# Altium schematic sheet K60FN_LQFP144.SchDoc
size A4
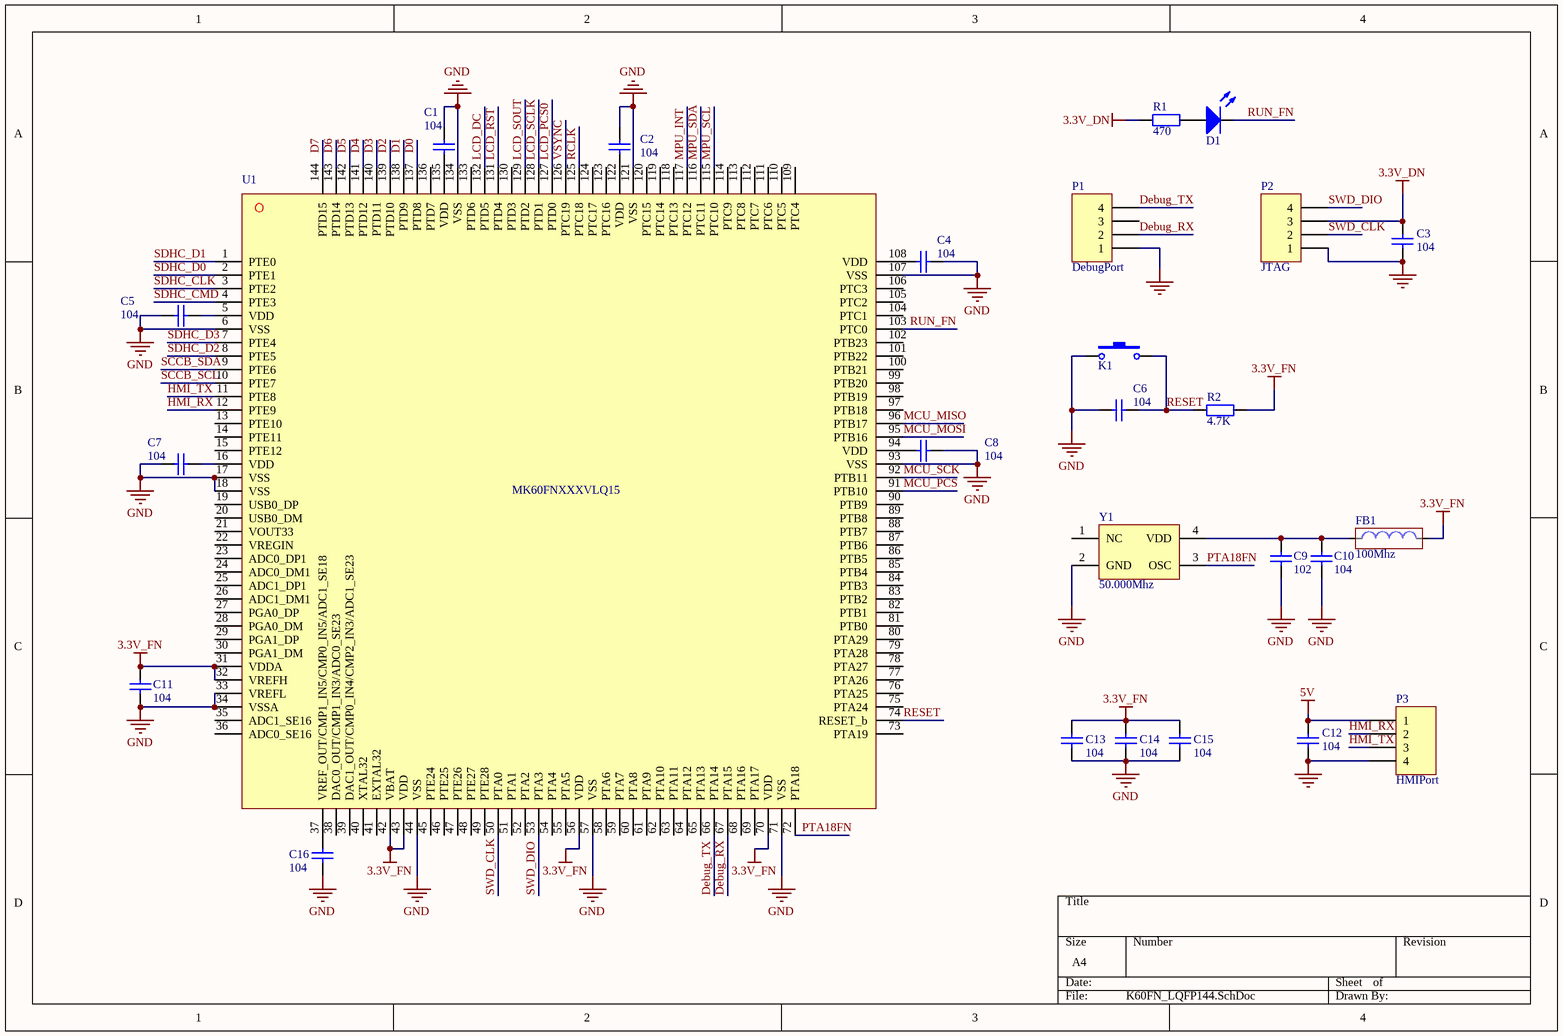
[diagram p0: K60FN_LQFP144.SchDoc]

## Parts
C1  104  [0805]
C2  104  [0805]
C3  104  [0805]
C4  104  [0805]
C5  104  [0805]
C6  104  [0805]
C7  104  [0805]
C8  104  [0805]
C9  102  [0805]
C10  104  [0805]
C11  104  [0805]
C12  104  [0805]
C13  104  [0805]
C14  104  [0805]
C15  104  [0805]
C16  104  [0805]
D1  Led  [0805]  (value not drawn)
FB1  100Mhz  [0805]
K1  SW-PB  [2P按键]  (value not drawn)
P1  DebugPort  [PJ-322]
P2  JTAG  [PJ-322]
P3  HMIPort  [4P-2.54]
R1  470  [0805]
R2  4.7K  [0805]
U1  MK60FNXXXVLQ15  [LQFP-144]
Y1  50.000Mhz  [XTAL-3225]

## Nets
3.3V_DN: C3.1 P2.3 R1.1
3.3V_FN: C11.2 C13.2 C14.2 C15.2 FB1.2 R2.2 U1.31(VDDA) U1.32(VREFH) U1.42(VBAT) U1.43(VDD) U1.56(VDD) U1.70(VDD)
5V: C12.2 P3.1
GND: C1.2 C2.2 C3.2 C4.1 C5.1 C6.1 C7.1 C8.1 C9.1 C10.1 C11.1 C12.1 C13.1 C14.1 C15.1 C16.1 K1.1 P1.1 P2.1 P3.4 U1.6(VSS) U1.17(VSS) U1.18(VSS) U1.33(VREFL) U1.34(VSSA) U1.44(VSS) U1.57(VSS) U1.71(VSS) U1.93(VSS) U1.107(VSS) U1.121(VSS) U1.134(VSS) Y1.2(GND)
D0: U1.137(PTD8)
D1: U1.138(PTD9)
D2: U1.139(PTD10)
D3: U1.140(PTD11)
D4: U1.141(PTD12)
D5: U1.142(PTD13)
D6: U1.143(PTD14)
D7: U1.144(PTD15)
Debug_RX: P1.2 U1.67(PTA15)
Debug_TX: P1.4 U1.66(PTA14)
HMI_RX: P3.2 U1.12(PTE9)
HMI_TX: P3.3 U1.11(PTE8)
LCD_DC: U1.132(PTD5)
LCD_PCS0: U1.127(PTD0)
LCD_RST: U1.131(PTD4)
LCD_SCLK: U1.128(PTD1)
LCD_SOUT: U1.129(PTD2)
MCU_MISO: U1.96(PTB17)
MCU_MOSI: U1.95(PTB16)
MCU_PCS: U1.91(PTB10)
MCU_SCK: U1.92(PTB11)
MPU_INT: U1.117(PTC12)
MPU_SCL: U1.115(PTC10)
MPU_SDA: U1.116(PTC11)
PTA18FN: U1.72(PTA18) Y1.3(OSC)
RCLK: U1.125(PTC18)
RESET: C6.2 K1.2 R2.1 U1.74(RESET_b)
RUN_FN: D1.2 U1.103(PTC0)
SCCB_SCL: U1.10(PTE7)
SCCB_SDA: U1.9(PTE6)
SDHC_CLK: U1.3(PTE2)
SDHC_CMD: U1.4(PTE3)
SDHC_D0: U1.2(PTE1)
SDHC_D1: U1.1(PTE0)
SDHC_D2: U1.8(PTE5)
SDHC_D3: U1.7(PTE4)
SWD_CLK: P2.2 U1.50(PTA0)
SWD_DIO: P2.4 U1.53(PTA3)
VSYNC: U1.126(PTC19)
NetC1_1: C1.1 U1.135(VDD)
NetC2_1: C2.1 U1.122(VDD)
NetC4_2: C4.2 U1.108(VDD)
NetC5_2: C5.2 U1.5(VDD)
NetC7_2: C7.2 U1.16(VDD)
NetC8_2: C8.2 U1.94(VDD)
NetC9_2: C9.2 C10.2 FB1.1 Y1.4(VDD)
NetC16_2: C16.2 U1.37(VREF_OUT/CMP1_IN5/CMP0_IN5/ADC1_SE18)
NetD1_1: D1.1 R1.2

Not connected (* = marked no-connect by the designer): P1 3; U1 13(PTE10) 14(PTE11) 15(PTE12) 19(USB0_DP) 20(USB0_DM) 21(VOUT33) 22(VREGIN) 23(ADC0_DP1) 24(ADC0_DM1) 25(ADC1_DP1) 26(ADC1_DM1) 27(PGA0_DP) 28(PGA0_DM) 29(PGA1_DP) 30(PGA1_DM) 35(ADC1_SE16) 36(ADC0_SE16) 38(DAC0_OUT/CMP1_IN3/ADC0_SE23) 39(DAC1_OUT/CMP0_IN4/CMP2_IN3/ADC1_SE23) 40(XTAL32) 41(EXTAL32) 45(PTE24) 46(PTE25) 47(PTE26) 48(PTE27) 49(PTE28) 51(PTA1) 52(PTA2) 54(PTA4) 55(PTA5) 58(PTA6) 59(PTA7) 60(PTA8) 61(PTA9) 62(PTA10) 63(PTA11) 64(PTA12) 65(PTA13) 68(PTA16) 69(PTA17) 73(PTA19) 75(PTA24) 76(PTA25) 77(PTA26) 78(PTA27) 79(PTA28) 80(PTA29) 81(PTB0) 82(PTB1) 83(PTB2) 84(PTB3) 85(PTB4) 86(PTB5) 87(PTB6) 88(PTB7) 89(PTB8) 90(PTB9) 97(PTB18) 98(PTB19) 99(PTB20) 100(PTB21) 101(PTB22) 102(PTB23) 104(PTC1) 105(PTC2) 106(PTC3) 109(PTC4) 110(PTC5) 111(PTC6) 112(PTC7) 113(PTC8) 114(PTC9) 118(PTC13) 119(PTC14) 120(PTC15) 123(PTC16) 124(PTC17) 130(PTD3) 133(PTD6) 136(PTD7); Y1 1(NC)

## Library data of the parts
C1-C16 = Cap
FB1 = Inductor
P1-P3 = Header 4: Header, 4-Pin; LatestRevisionDate: 17-Jul-2002; LatestRevisionNote: Re-released for DXP Platform.; Publisher: Altium Limited
R1 R2 = Rest
U1 = K60
Y1 = 有源晶振